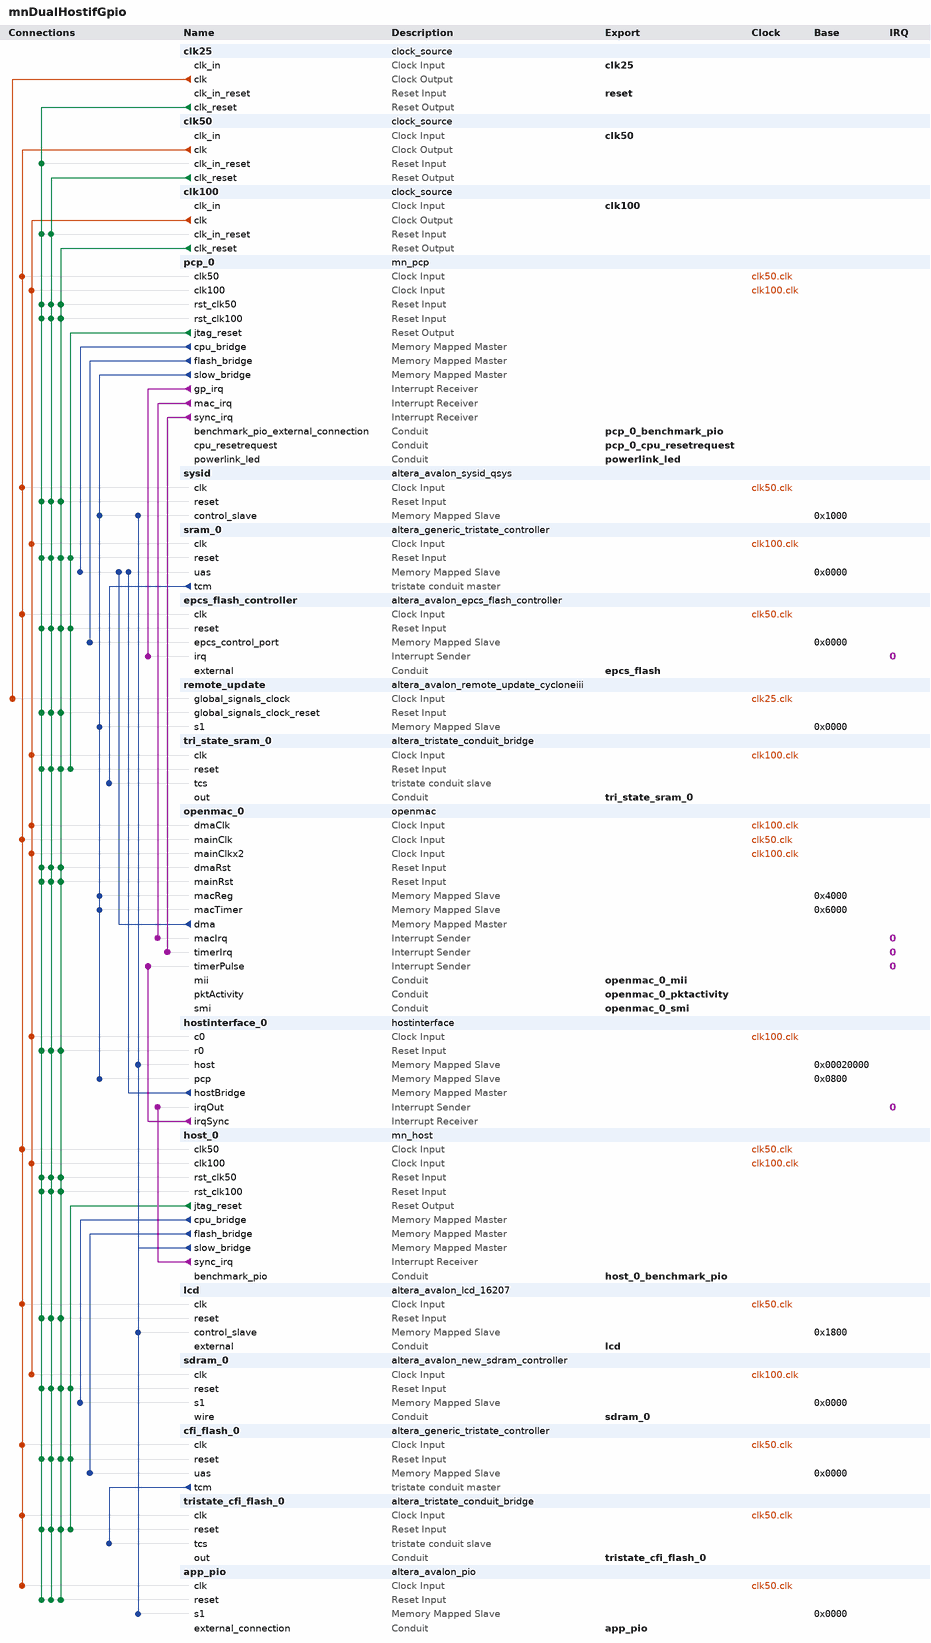
[diagram p0: system contents]
# Platform Designer (Qsys) system mnDualHostifGpio, Cyclone IV E EP4CE115F29C7
# Parameters at their usual value, and those the tool derives, are not listed.
package require -exact qsys 13.0
create_system mnDualHostifGpio
set_project_property DEVICE_FAMILY {Cyclone IV E}
set_project_property DEVICE EP4CE115F29C7

add_instance clk25 clock_source 13.0
set_instance_parameter_value clk25 clockFrequency 25000000

add_instance clk50 clock_source 13.0
set_instance_parameter_value clk50 clockFrequency 50000000

add_instance clk100 clock_source 13.0
set_instance_parameter_value clk100 clockFrequency 100000000

add_instance pcp_0 mn_pcp 1.0
set_instance_parameter_value pcp_0 cpu0_resetCpuBridge flash_bridge
set_instance_parameter_value pcp_0 tcmemSize 20480

add_instance sysid altera_avalon_sysid_qsys 13.0
set_instance_parameter_value sysid id 0

add_instance sram_0 altera_generic_tristate_controller 13.0
set_instance_parameter_value sram_0 TCM_ADDRESS_W 21
set_instance_parameter_value sram_0 TCM_DATA_W 16
set_instance_parameter_value sram_0 TCM_BYTEENABLE_W 2
set_instance_parameter_value sram_0 TCM_READ_WAIT 1
set_instance_parameter_value sram_0 TCM_WRITE_WAIT 0
set_instance_parameter_value sram_0 TCM_SETUP_WAIT 0
set_instance_parameter_value sram_0 TCM_DATA_HOLD 0
set_instance_parameter_value sram_0 TCM_MAX_PENDING_READ_TRANSACTIONS 1
set_instance_parameter_value sram_0 TCM_TURNAROUND_TIME 1
set_instance_parameter_value sram_0 TCM_TIMING_UNITS 1
set_instance_parameter_value sram_0 TCM_READLATENCY 2
set_instance_parameter_value sram_0 TCM_SYMBOLS_PER_WORD 2
set_instance_parameter_value sram_0 USE_READ 1
set_instance_parameter_value sram_0 USE_BEGINTRANSFER 0
set_instance_parameter_value sram_0 USE_BYTEENABLE 1
set_instance_parameter_value sram_0 USE_OUTPUTENABLE 0
set_instance_parameter_value sram_0 ACTIVE_LOW_READ 1
set_instance_parameter_value sram_0 ACTIVE_LOW_BYTEENABLE 1
set_instance_parameter_value sram_0 ACTIVE_LOW_OUTPUTENABLE 0
set_instance_parameter_value sram_0 ACTIVE_LOW_BEGINTRANSFER 0
set_instance_parameter_value sram_0 CHIPSELECT_THROUGH_READLATENCY 0
set_instance_parameter_value sram_0 MODULE_ASSIGNMENT_KEYS embeddedsw.CMacro.SIZE
set_instance_parameter_value sram_0 MODULE_ASSIGNMENT_VALUES 2097152

add_instance epcs_flash_controller altera_avalon_epcs_flash_controller 13.0.1.99.2

add_instance remote_update altera_avalon_remote_update_cycloneiii 13.0
set_instance_parameter_value remote_update clockFrequency 25000000

add_instance tri_state_sram_0 altera_tristate_conduit_bridge 13.0

add_instance openmac_0 openmac 1.0.2
set_instance_parameter_value openmac_0 gui_phyType 2
set_instance_parameter_value openmac_0 gui_phyCount 2
set_instance_parameter_value openmac_0 gui_extraSmi true
set_instance_parameter_value openmac_0 gui_txBufLoc 2
set_instance_parameter_value openmac_0 gui_txBufSize 1
set_instance_parameter_value openmac_0 gui_txBurstSize 8
set_instance_parameter_value openmac_0 gui_rxBurstSize 1
set_instance_parameter_value openmac_0 gui_tmrPulse true
set_instance_parameter_value openmac_0 gui_actEn true
set_instance_parameter_value openmac_0 gui_sdcEn true

add_instance hostinterface_0 hostinterface 1.0.2
set_instance_parameter_value hostinterface_0 sys_uniqueId 0
set_instance_parameter_value hostinterface_0 gui_sizeDynBuf0 2
set_instance_parameter_value hostinterface_0 gui_sizeDynBuf1 2
set_instance_parameter_value hostinterface_0 gui_sizeErrorCnter 3108
set_instance_parameter_value hostinterface_0 gui_sizeTxNmtQ 8
set_instance_parameter_value hostinterface_0 gui_sizeTxGenQ 8
set_instance_parameter_value hostinterface_0 gui_sizeTxSyncQ 8
set_instance_parameter_value hostinterface_0 gui_sizeTxVethQ 2
set_instance_parameter_value hostinterface_0 gui_sizeRxVethQ 2
set_instance_parameter_value hostinterface_0 gui_sizeK2UQ 4
set_instance_parameter_value hostinterface_0 gui_sizeU2KQ 4
set_instance_parameter_value hostinterface_0 gui_sizePdo 49152

add_instance host_0 mn_host 1.0

add_instance lcd altera_avalon_lcd_16207 13.0.1.99.2

add_instance sdram_0 altera_avalon_new_sdram_controller 13.0.1.99.2
set_instance_parameter_value sdram_0 TAC 6.0
set_instance_parameter_value sdram_0 TRCD 20.0
set_instance_parameter_value sdram_0 TRP 20.0
set_instance_parameter_value sdram_0 casLatency 3
set_instance_parameter_value sdram_0 columnWidth 10
set_instance_parameter_value sdram_0 dataWidth 32
set_instance_parameter_value sdram_0 generateSimulationModel false
set_instance_parameter_value sdram_0 model single_Micron_MT48LC4M32B2_7_chip
set_instance_parameter_value sdram_0 numberOfBanks 4
set_instance_parameter_value sdram_0 numberOfChipSelects 1
set_instance_parameter_value sdram_0 powerUpDelay 100.0
set_instance_parameter_value sdram_0 refreshPeriod 7.8125
set_instance_parameter_value sdram_0 rowWidth 13

add_instance cfi_flash_0 altera_generic_tristate_controller 13.0
set_instance_parameter_value cfi_flash_0 TCM_ADDRESS_W 23
set_instance_parameter_value cfi_flash_0 TCM_DATA_W 8
set_instance_parameter_value cfi_flash_0 TCM_BYTEENABLE_W 1
set_instance_parameter_value cfi_flash_0 TCM_READ_WAIT 160
set_instance_parameter_value cfi_flash_0 TCM_WRITE_WAIT 160
set_instance_parameter_value cfi_flash_0 TCM_SETUP_WAIT 60
set_instance_parameter_value cfi_flash_0 TCM_DATA_HOLD 60
set_instance_parameter_value cfi_flash_0 TCM_MAX_PENDING_READ_TRANSACTIONS 3
set_instance_parameter_value cfi_flash_0 TCM_TURNAROUND_TIME 2
set_instance_parameter_value cfi_flash_0 TCM_TIMING_UNITS 0
set_instance_parameter_value cfi_flash_0 TCM_READLATENCY 2
set_instance_parameter_value cfi_flash_0 TCM_SYMBOLS_PER_WORD 1
set_instance_parameter_value cfi_flash_0 USE_READ 1
set_instance_parameter_value cfi_flash_0 USE_BEGINTRANSFER 0
set_instance_parameter_value cfi_flash_0 USE_BYTEENABLE 0
set_instance_parameter_value cfi_flash_0 USE_OUTPUTENABLE 0
set_instance_parameter_value cfi_flash_0 ACTIVE_LOW_READ 1
set_instance_parameter_value cfi_flash_0 ACTIVE_LOW_BYTEENABLE 0
set_instance_parameter_value cfi_flash_0 ACTIVE_LOW_OUTPUTENABLE 0
set_instance_parameter_value cfi_flash_0 ACTIVE_LOW_BEGINTRANSFER 0
set_instance_parameter_value cfi_flash_0 CHIPSELECT_THROUGH_READLATENCY 0
set_instance_parameter_value cfi_flash_0 MODULE_ASSIGNMENT_KEYS embeddedsw.configuration.hwClassnameDriverSupportList,embeddedsw.configuration.hwClassnameDriverSupportDefault,embeddedsw.CMacro.SETUP_VALUE,embeddedsw.CMacro.WAIT_VALUE,embeddedsw.CMacro.HOLD_VALUE,embeddedsw.CMacro.TIMING_UNITS,embeddedsw.CMacro.SIZE,embeddedsw.memoryInfo.MEM_INIT_DATA_WIDTH,embeddedsw.memoryInfo.HAS_BYTE_LANE,embeddedsw.memoryInfo.IS_FLASH,embeddedsw.memoryInfo.GENERATE_DAT_SYM,embeddedsw.memoryInfo.GENERATE_FLASH,embeddedsw.memoryInfo.DAT_SYM_INSTALL_DIR,embeddedsw.memoryInfo.FLASH_INSTALL_DIR
set_instance_parameter_value cfi_flash_0 MODULE_ASSIGNMENT_VALUES altera_avalon_lan91c111:altera_avalon_cfi_flash,altera_avalon_cfi_flash,60,160,60,ns,8388608u,8,0,1,1,1,SIM_DIR,APP_DIR
set_instance_parameter_value cfi_flash_0 INTERFACE_ASSIGNMENT_KEYS embeddedsw.configuration.isFlash,embeddedsw.configuration.isMemoryDevice,embeddedsw.configuration.isNonVolatileStorage
set_instance_parameter_value cfi_flash_0 INTERFACE_ASSIGNMENT_VALUES 1,1,1

add_instance tristate_cfi_flash_0 altera_tristate_conduit_bridge 13.0

add_instance app_pio altera_avalon_pio 13.0.1.99.2
set_instance_parameter_value app_pio direction InOut
set_instance_parameter_value app_pio width 32

# connections
add_connection clk25.clk remote_update.global_signals_clock clock
add_connection clk50.clk app_pio.clk clock
add_connection clk50.clk cfi_flash_0.clk clock
add_connection clk50.clk epcs_flash_controller.clk clock
add_connection clk50.clk host_0.clk50 clock
add_connection clk50.clk lcd.clk clock
add_connection clk50.clk openmac_0.mainClk clock
add_connection clk50.clk pcp_0.clk50 clock
add_connection clk50.clk sysid.clk clock
add_connection clk50.clk tristate_cfi_flash_0.clk clock
add_connection clk100.clk host_0.clk100 clock
add_connection clk100.clk hostinterface_0.c0 clock
add_connection clk100.clk openmac_0.dmaClk clock
add_connection clk100.clk openmac_0.mainClkx2 clock
add_connection clk100.clk pcp_0.clk100 clock
add_connection clk100.clk sdram_0.clk clock
add_connection clk100.clk sram_0.clk clock
add_connection clk100.clk tri_state_sram_0.clk clock
add_connection clk25.clk_reset app_pio.reset reset
add_connection clk25.clk_reset cfi_flash_0.reset reset
add_connection clk25.clk_reset clk50.clk_in_reset reset
add_connection clk25.clk_reset clk100.clk_in_reset reset
add_connection clk25.clk_reset epcs_flash_controller.reset reset
add_connection clk25.clk_reset host_0.rst_clk50 reset
add_connection clk25.clk_reset host_0.rst_clk100 reset
add_connection clk25.clk_reset hostinterface_0.r0 reset
add_connection clk25.clk_reset lcd.reset reset
add_connection clk25.clk_reset openmac_0.dmaRst reset
add_connection clk25.clk_reset openmac_0.mainRst reset
add_connection clk25.clk_reset pcp_0.rst_clk50 reset
add_connection clk25.clk_reset pcp_0.rst_clk100 reset
add_connection clk25.clk_reset remote_update.global_signals_clock_reset reset
add_connection clk25.clk_reset sdram_0.reset reset
add_connection clk25.clk_reset sram_0.reset reset
add_connection clk25.clk_reset sysid.reset reset
add_connection clk25.clk_reset tri_state_sram_0.reset reset
add_connection clk25.clk_reset tristate_cfi_flash_0.reset reset
add_connection clk50.clk_reset app_pio.reset reset
add_connection clk50.clk_reset cfi_flash_0.reset reset
add_connection clk50.clk_reset clk100.clk_in_reset reset
add_connection clk50.clk_reset epcs_flash_controller.reset reset
add_connection clk50.clk_reset host_0.rst_clk50 reset
add_connection clk50.clk_reset host_0.rst_clk100 reset
add_connection clk50.clk_reset hostinterface_0.r0 reset
add_connection clk50.clk_reset lcd.reset reset
add_connection clk50.clk_reset openmac_0.dmaRst reset
add_connection clk50.clk_reset openmac_0.mainRst reset
add_connection clk50.clk_reset pcp_0.rst_clk50 reset
add_connection clk50.clk_reset pcp_0.rst_clk100 reset
add_connection clk50.clk_reset remote_update.global_signals_clock_reset reset
add_connection clk50.clk_reset sdram_0.reset reset
add_connection clk50.clk_reset sram_0.reset reset
add_connection clk50.clk_reset sysid.reset reset
add_connection clk50.clk_reset tri_state_sram_0.reset reset
add_connection clk50.clk_reset tristate_cfi_flash_0.reset reset
add_connection clk100.clk_reset app_pio.reset reset
add_connection clk100.clk_reset cfi_flash_0.reset reset
add_connection clk100.clk_reset epcs_flash_controller.reset reset
add_connection clk100.clk_reset host_0.rst_clk50 reset
add_connection clk100.clk_reset host_0.rst_clk100 reset
add_connection clk100.clk_reset hostinterface_0.r0 reset
add_connection clk100.clk_reset lcd.reset reset
add_connection clk100.clk_reset openmac_0.dmaRst reset
add_connection clk100.clk_reset openmac_0.mainRst reset
add_connection clk100.clk_reset pcp_0.rst_clk50 reset
add_connection clk100.clk_reset pcp_0.rst_clk100 reset
add_connection clk100.clk_reset remote_update.global_signals_clock_reset reset
add_connection clk100.clk_reset sdram_0.reset reset
add_connection clk100.clk_reset sram_0.reset reset
add_connection clk100.clk_reset sysid.reset reset
add_connection clk100.clk_reset tri_state_sram_0.reset reset
add_connection clk100.clk_reset tristate_cfi_flash_0.reset reset
add_connection host_0.jtag_reset cfi_flash_0.reset reset
add_connection host_0.jtag_reset sdram_0.reset reset
add_connection host_0.jtag_reset tristate_cfi_flash_0.reset reset
add_connection pcp_0.jtag_reset epcs_flash_controller.reset reset
add_connection pcp_0.jtag_reset sram_0.reset reset
add_connection pcp_0.jtag_reset tri_state_sram_0.reset reset
add_connection host_0.cpu_bridge sdram_0.s1 avalon
set_connection_parameter_value host_0.cpu_bridge/sdram_0.s1 baseAddress 0x0000
add_connection host_0.flash_bridge cfi_flash_0.uas avalon
set_connection_parameter_value host_0.flash_bridge/cfi_flash_0.uas baseAddress 0x0000
add_connection host_0.slow_bridge app_pio.s1 avalon
set_connection_parameter_value host_0.slow_bridge/app_pio.s1 baseAddress 0x0000
add_connection host_0.slow_bridge hostinterface_0.host avalon
set_connection_parameter_value host_0.slow_bridge/hostinterface_0.host baseAddress 0x00020000
add_connection host_0.slow_bridge lcd.control_slave avalon
set_connection_parameter_value host_0.slow_bridge/lcd.control_slave baseAddress 0x1800
add_connection host_0.slow_bridge sysid.control_slave avalon
set_connection_parameter_value host_0.slow_bridge/sysid.control_slave baseAddress 0x1000
add_connection hostinterface_0.hostBridge sram_0.uas avalon
set_connection_parameter_value hostinterface_0.hostBridge/sram_0.uas baseAddress 0x0000
add_connection openmac_0.dma sram_0.uas avalon
set_connection_parameter_value openmac_0.dma/sram_0.uas baseAddress 0x0000
add_connection pcp_0.cpu_bridge sram_0.uas avalon
set_connection_parameter_value pcp_0.cpu_bridge/sram_0.uas baseAddress 0x0000
add_connection pcp_0.flash_bridge epcs_flash_controller.epcs_control_port avalon
set_connection_parameter_value pcp_0.flash_bridge/epcs_flash_controller.epcs_control_port baseAddress 0x0000
add_connection pcp_0.slow_bridge hostinterface_0.pcp avalon
set_connection_parameter_value pcp_0.slow_bridge/hostinterface_0.pcp baseAddress 0x0800
add_connection pcp_0.slow_bridge openmac_0.macReg avalon
set_connection_parameter_value pcp_0.slow_bridge/openmac_0.macReg baseAddress 0x4000
add_connection pcp_0.slow_bridge openmac_0.macTimer avalon
set_connection_parameter_value pcp_0.slow_bridge/openmac_0.macTimer baseAddress 0x6000
add_connection pcp_0.slow_bridge remote_update.s1 avalon
set_connection_parameter_value pcp_0.slow_bridge/remote_update.s1 baseAddress 0x0000
add_connection pcp_0.slow_bridge sysid.control_slave avalon
set_connection_parameter_value pcp_0.slow_bridge/sysid.control_slave baseAddress 0x1000
add_connection host_0.sync_irq hostinterface_0.irqOut interrupt
set_connection_parameter_value host_0.sync_irq/hostinterface_0.irqOut irqNumber 0
add_connection hostinterface_0.irqSync openmac_0.timerPulse interrupt
set_connection_parameter_value hostinterface_0.irqSync/openmac_0.timerPulse irqNumber 0
add_connection pcp_0.gp_irq epcs_flash_controller.irq interrupt
set_connection_parameter_value pcp_0.gp_irq/epcs_flash_controller.irq irqNumber 0
add_connection pcp_0.mac_irq openmac_0.macIrq interrupt
set_connection_parameter_value pcp_0.mac_irq/openmac_0.macIrq irqNumber 0
add_connection pcp_0.sync_irq openmac_0.timerIrq interrupt
set_connection_parameter_value pcp_0.sync_irq/openmac_0.timerIrq irqNumber 0
add_connection cfi_flash_0.tcm tristate_cfi_flash_0.tcs tristate_conduit
add_connection sram_0.tcm tri_state_sram_0.tcs tristate_conduit

# exported interfaces
add_interface clk50 clock sink
set_interface_property clk50 EXPORT_OF clk50.clk_in
add_interface clk100 clock sink
set_interface_property clk100 EXPORT_OF clk100.clk_in
add_interface clk25 clock sink
set_interface_property clk25 EXPORT_OF clk25.clk_in
add_interface reset reset sink
set_interface_property reset EXPORT_OF clk25.clk_in_reset
add_interface pcp_0_benchmark_pio conduit end
set_interface_property pcp_0_benchmark_pio EXPORT_OF pcp_0.benchmark_pio_external_connection
add_interface host_0_benchmark_pio conduit end
set_interface_property host_0_benchmark_pio EXPORT_OF host_0.benchmark_pio
add_interface epcs_flash conduit end
set_interface_property epcs_flash EXPORT_OF epcs_flash_controller.external
add_interface tri_state_sram_0 conduit end
set_interface_property tri_state_sram_0 EXPORT_OF tri_state_sram_0.out
add_interface lcd conduit end
set_interface_property lcd EXPORT_OF lcd.external
add_interface openmac_0_mii conduit end
set_interface_property openmac_0_mii EXPORT_OF openmac_0.mii
add_interface openmac_0_smi conduit end
set_interface_property openmac_0_smi EXPORT_OF openmac_0.smi
add_interface pcp_0_cpu_resetrequest conduit end
set_interface_property pcp_0_cpu_resetrequest EXPORT_OF pcp_0.cpu_resetrequest
add_interface sdram_0 conduit end
set_interface_property sdram_0 EXPORT_OF sdram_0.wire
add_interface tristate_cfi_flash_0 conduit end
set_interface_property tristate_cfi_flash_0 EXPORT_OF tristate_cfi_flash_0.out
add_interface powerlink_led conduit end
set_interface_property powerlink_led EXPORT_OF pcp_0.powerlink_led
add_interface openmac_0_pktactivity conduit end
set_interface_property openmac_0_pktactivity EXPORT_OF openmac_0.pktActivity
add_interface app_pio conduit end
set_interface_property app_pio EXPORT_OF app_pio.external_connection

set_interconnect_requirement {$system} qsys_mm.clockCrossingAdapter HANDSHAKE
set_interconnect_requirement {$system} qsys_mm.maxAdditionalLatency 1

save_system mnDualHostifGpio.qsys
